# EasyEDA schematic EASY_EDA_PROJECT.json
TITLE: TKR1A1; REV: 1.0.1; Date: 2022-10-30; Sheet: 1/1; Drawn By: Francesco Vezzani
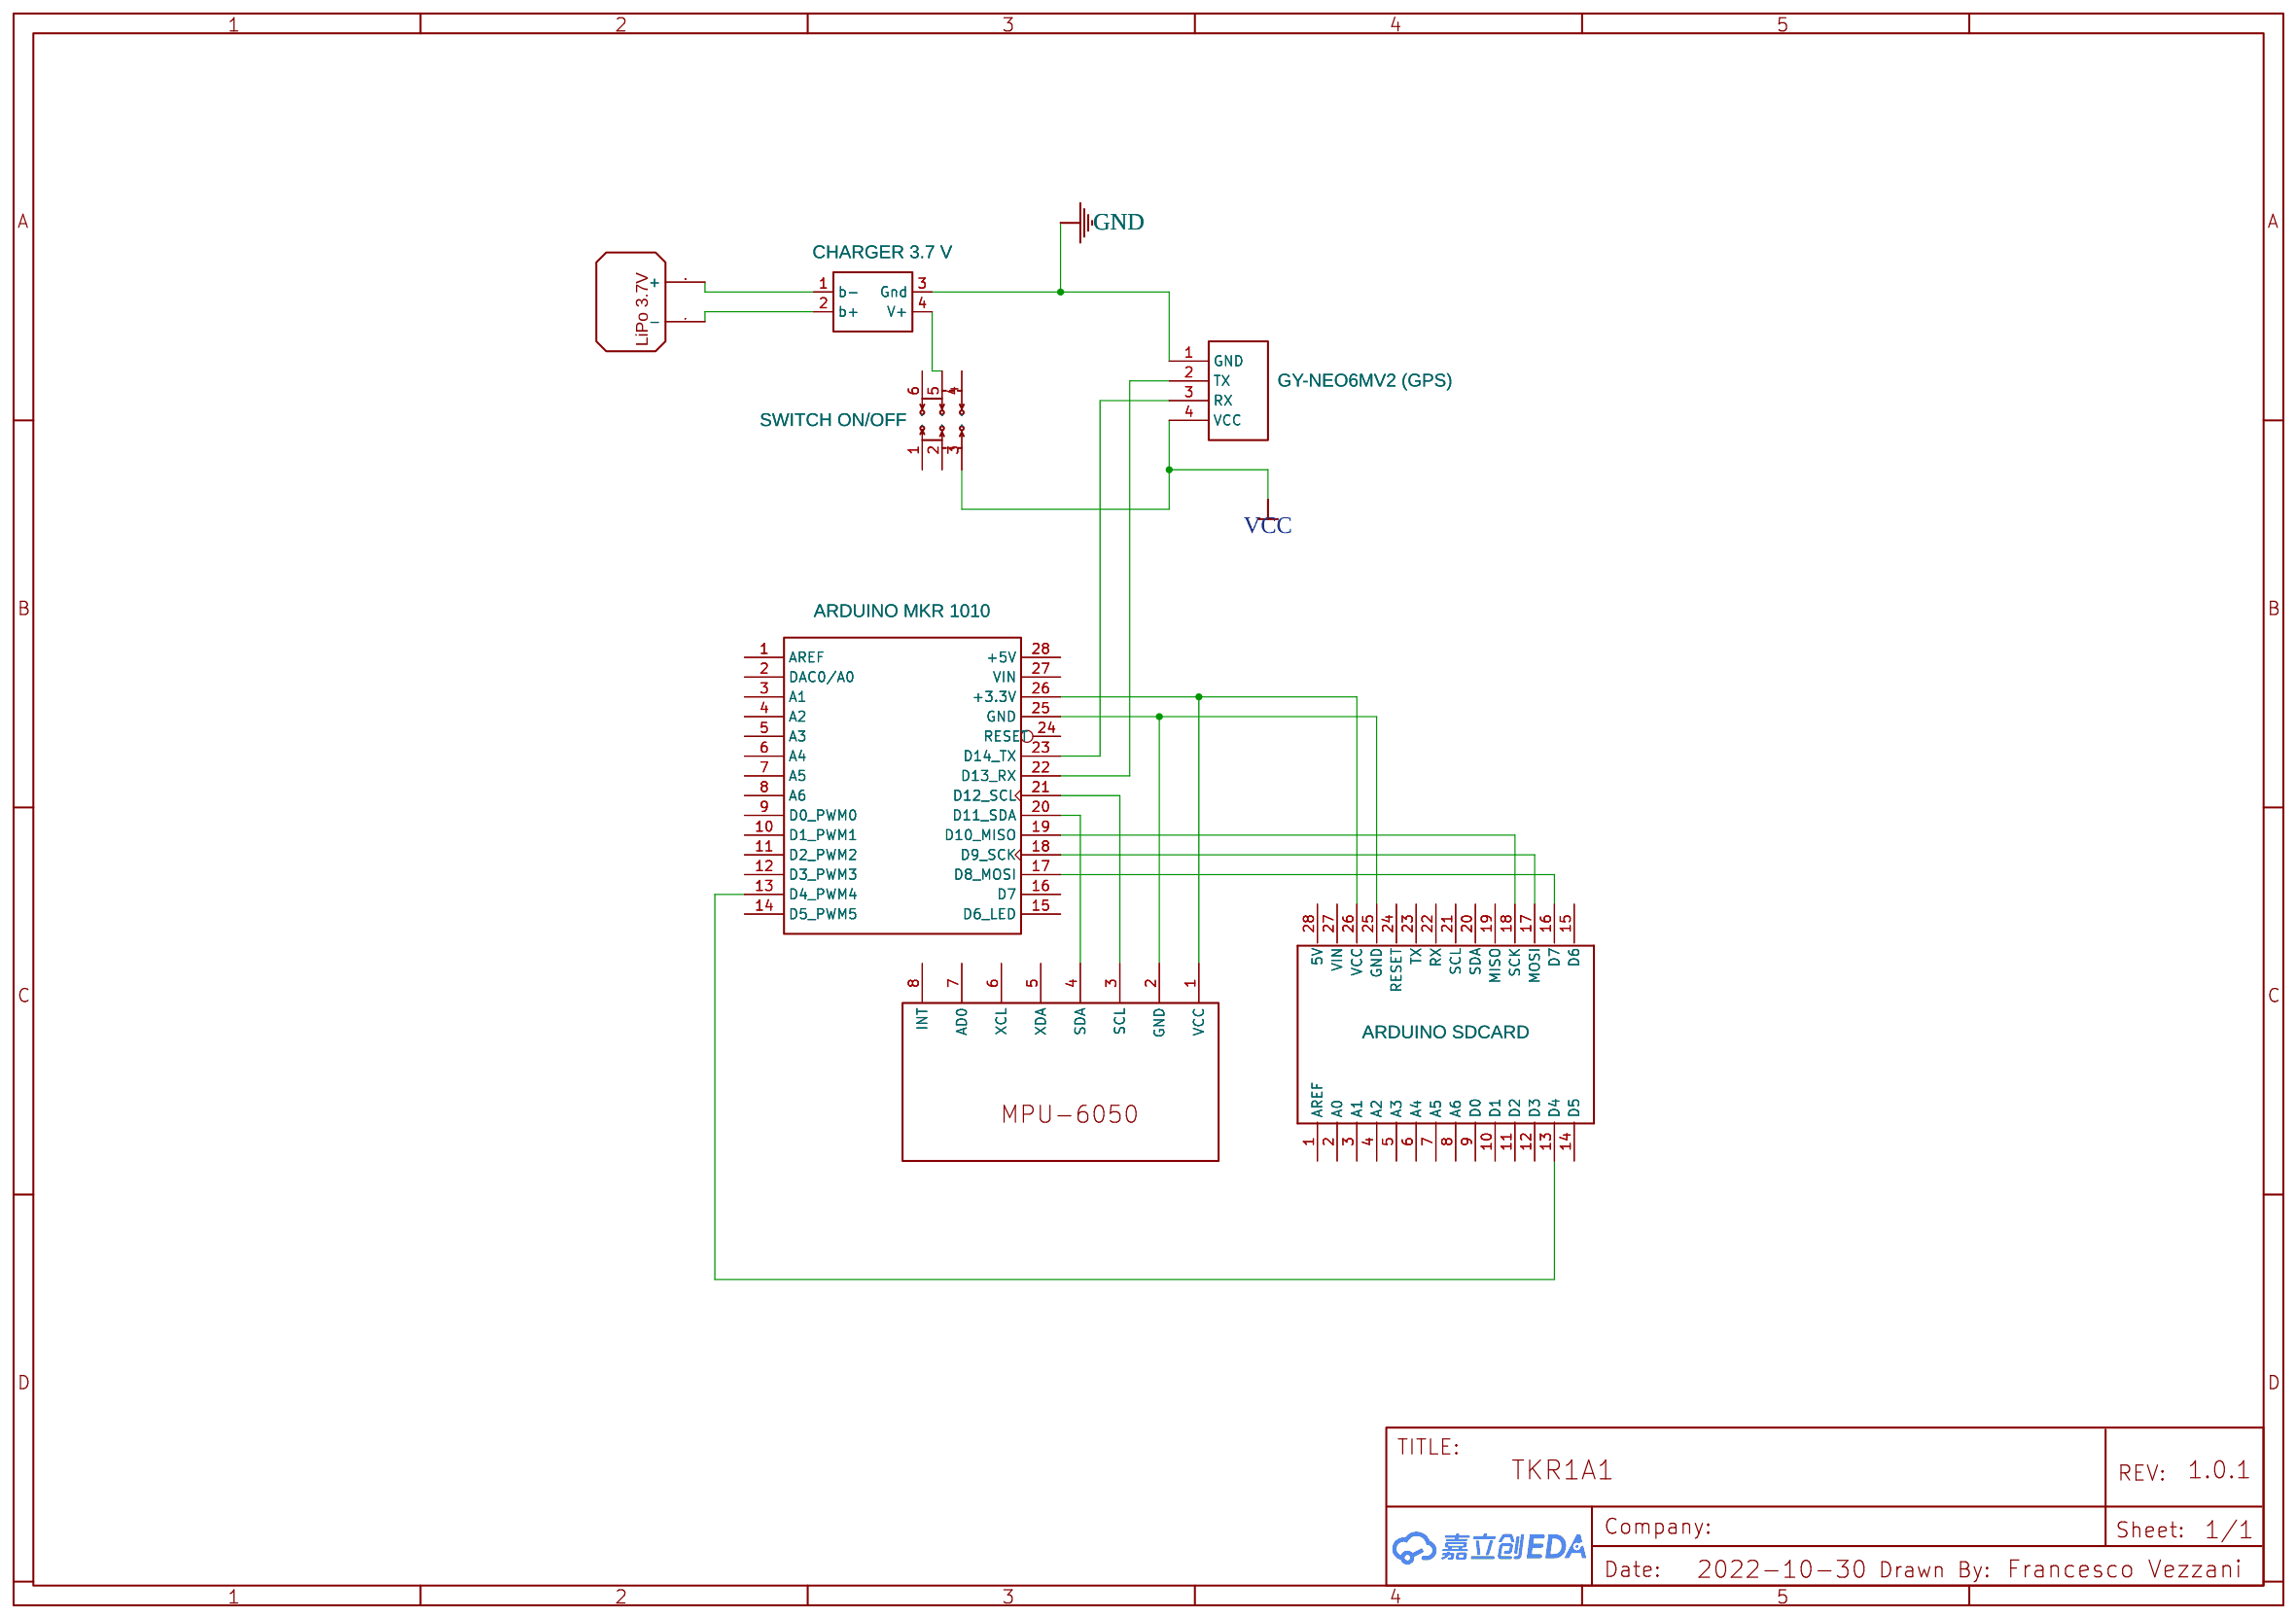
[diagram p0: schematic sheet]

## Parts
CHRAGER1  CHARGER 3.7 V  [BATTERY_CHARGER_3.7V]
M1  ARDUINO MKR 1010  [ARDUINO_MKR_1010]
SW1  SWITCH ON/OFF  [SW-TH_G-SWITCH_SS-22F29-G070]
U2  MPU-6050  [MPU-6050]
U3  GY-NEO6MV2 (GPS)  [GY-NEO6MV2]
U4  ARDUINO SDCARD  [ARDUINO-MKR-BLANK]
U5  3.7V 20000MAH LI-PO BATTERY  [3.7V 500MAH LI-PO BATTERY]

## Library data of the parts
CHRAGER1 = Battery_Charger_3.7v: Contributor: korkisborkis
M1 = ARDUINO MKR 1010: Manufacturer Part: Arduino MKR1000; Contributor: Ginodel
SW1 = SS-22F29-G070: Supplier: LCSC; Supplier Part: C2848893; Manufacturer: G-Switch(品赞); Contributor: LCSC
U2 = MPU-6050: Contributor: ronan01
U3 = GY-NEO6MV2: Contributor: Michaël Pégeot
U4 = ARDUINO_MKR_BLANK: Contributor: Jim Gray
U5 = 3.7V 500MAH LI-PO BATTERY: Contributor: don97; Package Display: No

## Nets
GND: CHRAGER1.3(Gnd) U3.1(GND)
VCC: SW1.3 U3.4(VCC)
Net-(CHRAGER1-1): CHRAGER1.1(b-) U5.2(+)
Net-(CHRAGER1-2): CHRAGER1.2(b+) U5.1(-)
Net-(CHRAGER1-4): CHRAGER1.4(V+) SW1.5
Net-(M1-13): M1.13(D4_PWM4) U4.13(D4)
Net-(M1-17): M1.17(D8_MOSI) U4.16(D7)
Net-(M1-18): M1.18(D9_SCK) U4.17(MOSI)
Net-(M1-19): M1.19(D10_MISO) U4.18(SCK)
Net-(M1-20): M1.20(D11_SDA) U2.4(SDA)
Net-(M1-21): M1.21(D12_SCL) U2.3(SCL)
Net-(M1-22): M1.22(D13_RX) U3.2(TX)
Net-(M1-23): M1.23(D14_TX) U3.3(RX)
Net-(M1-25): M1.25(GND) U2.2(GND) U4.25(GND)
Net-(M1-26): M1.26(+3.3V) U2.1(VCC) U4.26(VCC)

Not connected (* = marked no-connect by the designer): M1 1(AREF) 2(DAC0/A0) 3(A1) 4(A2) 5(A3) 6(A4) 7(A5) 8(A6) 9(D0_PWM0) 10(D1_PWM1) 11(D2_PWM2) 12(D3_PWM3) 14(D5_PWM5) 15(D6_LED) 16(D7) 24(RESET) 27(VIN) 28(+5V); SW1 1 2 4 6; U2 5(XDA) 6(XCL) 7(AD0) 8(INT); U4 1(AREF) 2(A0) 3(A1) 4(A2) 5(A3) 6(A4) 7(A5) 8(A6) 9(D0) 10(D1) 11(D2) 12(D3) 14(D5) 15(D6) 19(MISO) 20(SDA) 21(SCL) 22(RX) 23(TX) 24(RESET) 27(VIN) 28(5V)
